# Altium schematic sheet ZYBO_HDMI_Adapter.SchDoc
size A4; SheetNumber: 1; SheetTotal: 1
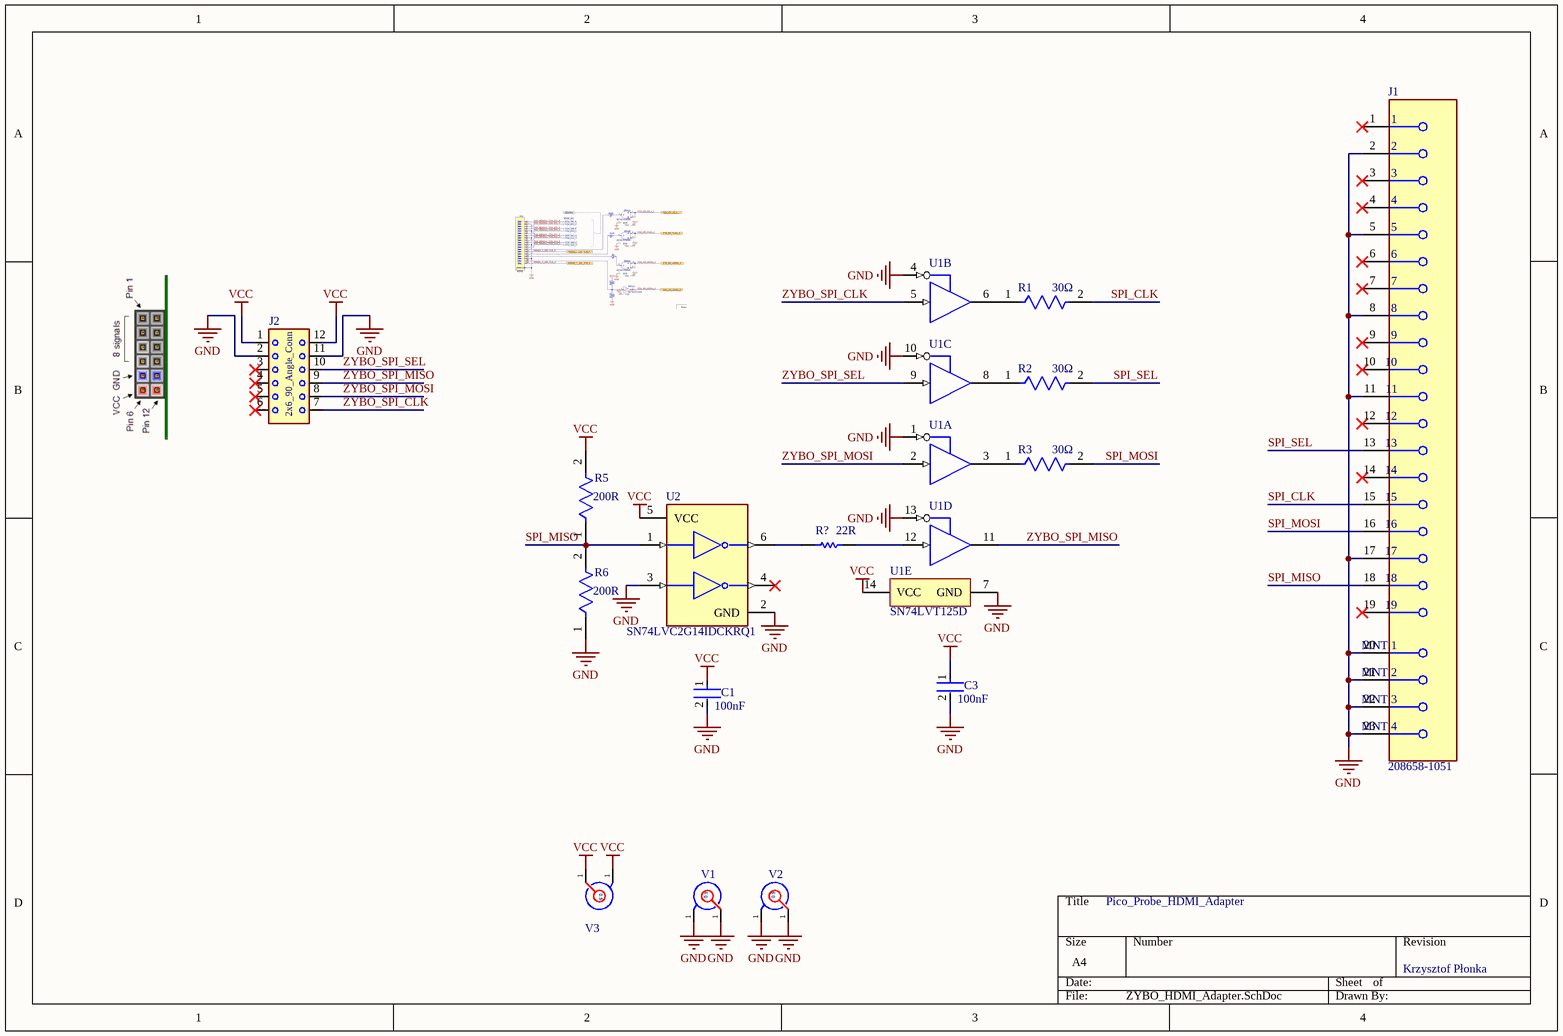
[diagram p0: ZYBO_HDMI_Adapter.SchDoc]

## Parts
C1  value 100nF  [FP-GRM033-0_03-IPC_A]  (hidden comment: GRM033Z71C104KE14J)
C3  value 100nF  [FP-GRM033-0_03-IPC_A]  (hidden comment: GRM033Z71C104KE14J)
J1  208658-1051  [FP-208658-1051-MFG]
J2  2X6_Male_90_Angle_Conn  [2X6_Male_90_Angle_Conn]  (value not drawn)
R1  Resistance: 30Ω  [FP-ERJ2RK-MFG]  (hidden comment: ERJ-2RKF30R0X)
R2  Resistance: 30Ω  [FP-ERJ2RK-MFG]  (hidden comment: ERJ-2RKF30R0X)
R3  Resistance: 30Ω  [FP-ERJ2RK-MFG]  (hidden comment: ERJ-2RKF30R0X)
R5  Resistance: 200R  [FP-CRCW0402-e3-IPC_C]  (hidden comment: CRCW0402200RFKED)
R6  Resistance: 200R  [FP-CRCW0402-e3-IPC_C]  (hidden comment: CRCW0402200RFKED)
R?  value 22R  [RESC1005X40X25ML10T10]  (hidden comment: CR0402-FX-22R0GLF)
U1  SN74LVT125D  [D0014A_M]  (value not drawn)  (parts A,B,C,D,E of 5)
U2  SN74LVC2G14IDCKRQ1  [FP-DCK0006A-MFG]
V1  Copper_Via_09  [Copper_Via_09]  (value not drawn)
V2  Copper_Via_09  [Copper_Via_09]  (value not drawn)
V3  Copper_Via_09  [Copper_Via_09]  (value not drawn)

## Nets
GND: C1.2 C3.2 J1.2 J1.5 J1.8 J1.11 J1.17 J1.20(MNT_1) J1.21(MNT_2) J1.22(MNT_3) J1.23(MNT_4) J2.2 J2.11 R6.1 U1.1(1~{OE}) U1.4(2~{OE}) U1.7(GND) U1.10(3~{OE}) U1.13(4~{OE}) U2.2(GND) U2.3(2A) V1.1 V2.1
VCC: C1.1 C3.1 J2.1 J2.12 R5.2 U1.14(VCC) U2.5(VCC) V3.1
SPI_CLK: J1.15 R1.2
SPI_MISO: J1.18 R5.1 R6.2 U2.1(1A)
SPI_MOSI: J1.16 R3.2
SPI_SEL: J1.13 R2.2
ZYBO_SPI_CLK: J2.7 U1.5(2A)
ZYBO_SPI_MISO: J2.9 U1.11(4Y)
ZYBO_SPI_MOSI: J2.8 U1.2(1A)
ZYBO_SPI_SEL: J2.10 U1.9(3A)
NetR1_1: R1.1 U1.6(2Y)
NetR2_1: R2.1 U1.8(3Y)
NetR3_1: R3.1 U1.3(1Y)
NetR?_1: R?.1 U2.6(1Y)
NetR?_2: R?.2 U1.12(4A)

Not connected (* = marked no-connect by the designer): J1 1* 3* 4* 6* 7* 9* 10* 12* 14* 19*; J2 3* 4* 5* 6*; U2 4(2Y)*

## Notes on the sheet
- Pico_Probe_HDMI_Adapter
- Krzysztof Płonka
- (in symbol 2X6_Male_90_Angle_Conn) 2x6_90_Angle_Conn
- (in symbol Copper_Via_09) 0.9

## Library data of the parts
C1 C3 = CMP-06035-043202-1: Chip Multilayer Ceramic Capacitors for General Purpose, 0201, 0.10uF, X7R, 15%, 10%, 16V
J1 = CMP-04768-000005-1: CONN RCPT HDMI V2.1 19POS SMD RA
J2 = 2X6_Male_90_Angle_Conn: 2x16 right angle connector
R1-R3 = CMP-2002-00857-2: NexarPartId: 42824405; Power Rating: 100mW; Voltage Rating: 50V; Temperature Coefficient: 100ppm/°C; Tolerance: 1%; Width: 508µm; Contact Plating: Tin; REACH SVHC: Yes; Case Code (Imperial): 0402; Composition: Thick Film; Number of Terminations: 2; Lead Free: Lead Free; Schedule B: 8533210045, 8533210045; Length: 1mm; Features: Automotive AEC-Q200; Military Standard: Not; Termination: SMD/SMT; Min Operating Temperature: -55°C; Mount: Surface Mount; RoHS: Compliant; Max Operating Temperature: 155°C; Height: 350µm; Case/Package: 0402; Max Power Dissipation: 100mW; Depth: 500µm; Case Code (Metric): 1005; Voltage Rating (DC): 50V; Lifecycle Status: Production; Packaging: Cut Tape
R5 R6 = CMP-1011-00429-3: RES Thick Film, 200Ω, 1%, 0.063W, 100ppm/°C, 0402; Max Power Dissipation: 63mW; Voltage Rating: 50V; Termination: SMD/SMT; Weight: 2.3E-05oz; Case/Package: 0402; Contact Plating: Tin; Number of Pins: 2; Width: 0.5mm; Height: 0.35mm; Case Code (Metric): 1005; Military Standard: Not; Features: Automotive AEC-Q200; Power Rating: 63mW; Temperature Coefficient: 100ppm/°C; Tolerance: 1%; Lead Free: Lead Free; Depth: 0.5mm; Max Operating Temperature: 155°C; Min Operating Temperature: -55°C; Package Quantity: 10; Voltage Rating (DC): 50V; Composition: Thick Film; Mount: Surface Mount; Radiation Hardening: No; Length: 1mm; Packaging: Tape and Reel; Number of Terminations: 2; Case Code (Imperial): 0402
R? = CMP-2002-04945-1: Manufacturer: Bourns; Part Number: CR0402-FX-22R0GLF
U1 = CMP-0440-00024-3: 3.3-V ABT Quadruple Bus Buffers With 3-State Outputs, D0014A, TUBE; Manufacturer: Texas Instruments; Input Type: TTL/CMOS; VCC(Min)(V): 2.7; tpd @ Nom Voltage(Max)(ns): 4; Output Type: LVTTL; F @ Nom Voltage(Max)(Mhz): 100; Voltage(Nom)(V): 3.3; Rating: Catalog; ICC @ Nom Voltage(Max)(mA): 0.007; VCC(Max)(V): 3.6; Generic Part Number: SN74LVT125; Bits(#): 4; Code_JEDEC: MS-012; DatasheetVersion: SCBS133F; Operating Temperature Range(C): -40 to 85; PackageReference: D0014A; PackageVersion: http://www.ti.com/lit/ml/mpds177g/mpds177g.pdf
U2 = CMP-0859-00447-5: IC INVERT SCHMITT 2CH 2IN SC70-6; Propagation Delay: 9.5ns; Number of Inputs: 1; Min Supply Voltage: 1.65V; Turn-On Delay Time: 4.3ns; Max Supply Voltage: 5.5V; Schmitt Trigger Input: Yes; Quiescent Current: 10uA; Number of Elements: 2; Max Output Current: 32mA; Input Type: SCHMITT TRIGGER; High Level Output Current: -32mA; Logic Function: Buffer; Width: 1.25mm; Lead Free: Lead Free; Package Quantity: 3000; Min Operating Temperature: -40°C; Termination: SMD/SMT; Mount: Surface Mount; Radiation Hardening: No; Number of Pins: 6; Height: 0.9mm; Output Current: 32mA; REACH SVHC: No SVHC; RoHS Compliant: Yes; Contact Plating: Gold; Max Operating Temperature: 85°C; Length: 2mm; Number of Bits: 2; Number of Circuits: 2; Technology: CMOS; Number of Gates: 2; Low Level Output Current: 32mA; Case/Package: SC; Packaging: Tape and Reel; Series: 74LVC
V1-V3 = Copper_Via_09: Copper Via 0.9mm hole